# EAGLE schematic RFRemote (EAGLE 6.3)
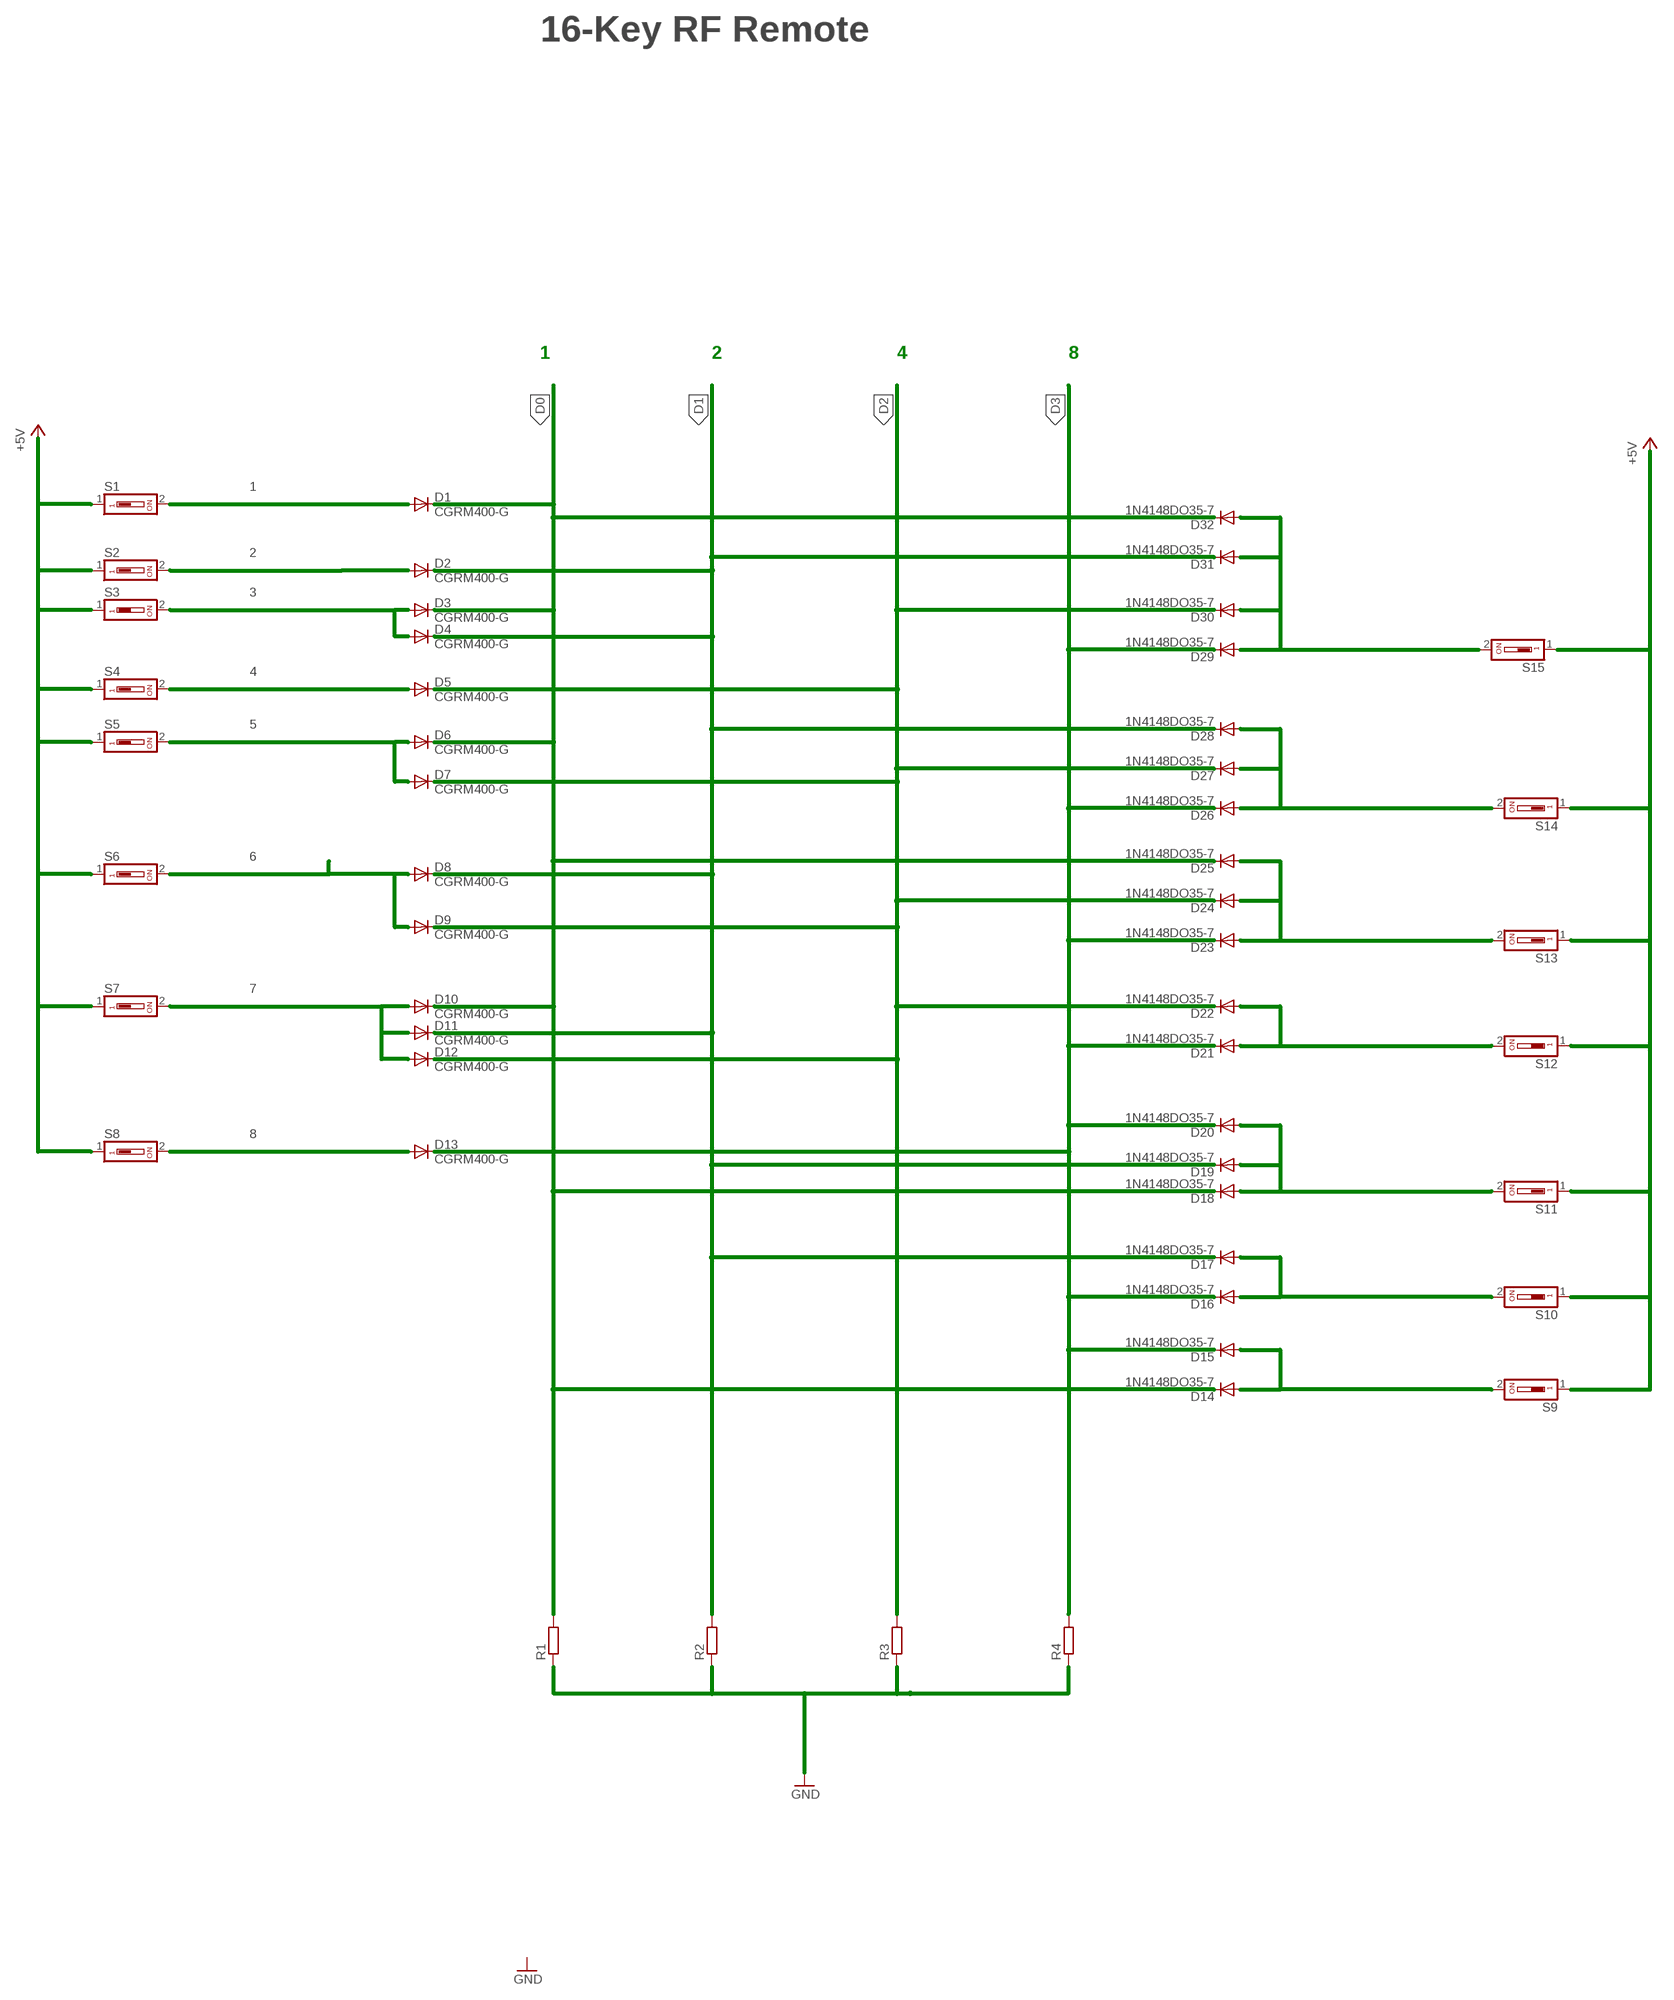
[diagram p0: schematic, sheet 1, part 1 of 2]
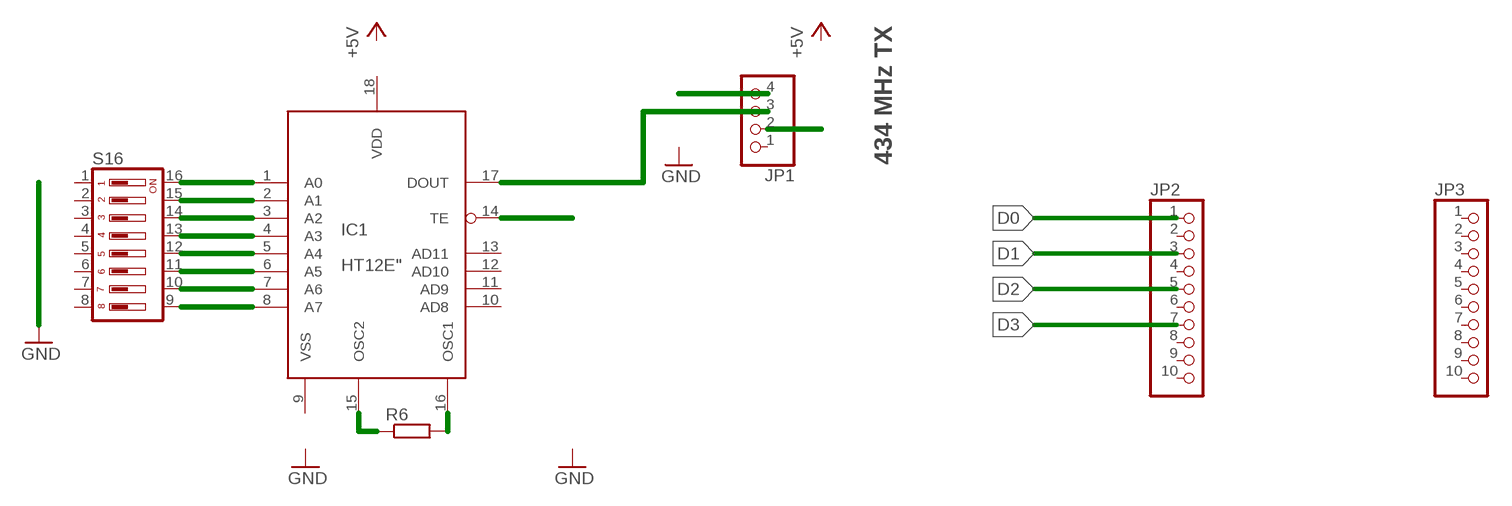
[diagram p1: schematic, sheet 1, part 2 of 2]

## Parts
D1  CGRM400-G  DIODE-3MELF-MLL41  [MELF-MLL41]
D2  CGRM400-G  DIODE-3MELF-MLL41  [MELF-MLL41]
D3  CGRM400-G  DIODE-3MELF-MLL41  [MELF-MLL41]
D4  CGRM400-G  DIODE-3MELF-MLL41  [MELF-MLL41]
D5  CGRM400-G  DIODE-3MELF-MLL41  [MELF-MLL41]
D6  CGRM400-G  DIODE-3MELF-MLL41  [MELF-MLL41]
D7  CGRM400-G  DIODE-3MELF-MLL41  [MELF-MLL41]
D8  CGRM400-G  DIODE-3MELF-MLL41  [MELF-MLL41]
D9  CGRM400-G  DIODE-3MELF-MLL41  [MELF-MLL41]
D10  CGRM400-G  DIODE-3MELF-MLL41  [MELF-MLL41]
D11  CGRM400-G  DIODE-3MELF-MLL41  [MELF-MLL41]
D12  CGRM400-G  DIODE-3MELF-MLL41  [MELF-MLL41]
D13  CGRM400-G  DIODE-3MELF-MLL41  [MELF-MLL41]
D14  1N4148DO35-7  DIODE-MELF-MLL41  [MELF-MLL41]
D15  1N4148DO35-7  DIODE-MELF-MLL41  [MELF-MLL41]
D16  1N4148DO35-7  DIODE-MELF-MLL41  [MELF-MLL41]
D17  1N4148DO35-7  DIODE-MELF-MLL41  [MELF-MLL41]
D18  1N4148DO35-7  DIODE-MELF-MLL41  [MELF-MLL41]
D19  1N4148DO35-7  DIODE-MELF-MLL41  [MELF-MLL41]
D20  1N4148DO35-7  DIODE-MELF-MLL41  [MELF-MLL41]
D21  1N4148DO35-7  DIODE-MELF-MLL41  [MELF-MLL41]
D22  1N4148DO35-7  DIODE-MELF-MLL41  [MELF-MLL41]
D23  1N4148DO35-7  DIODE-MELF-MLL41  [MELF-MLL41]
D24  1N4148DO35-7  DIODE-MELF-MLL41  [MELF-MLL41]
D25  1N4148DO35-7  DIODE-MELF-MLL41  [MELF-MLL41]
D26  1N4148DO35-7  DIODE-MELF-MLL41  [MELF-MLL41]
D27  1N4148DO35-7  DIODE-MELF-MLL41  [MELF-MLL41]
D28  1N4148DO35-7  DIODE-MELF-MLL41  [MELF-MLL41]
D29  1N4148DO35-7  DIODE-MELF-MLL41  [MELF-MLL41]
D30  1N4148DO35-7  DIODE-MELF-MLL41  [MELF-MLL41]
D31  1N4148DO35-7  DIODE-MELF-MLL41  [MELF-MLL41]
D32  1N4148DO35-7  DIODE-MELF-MLL41  [MELF-MLL41]
IC1  HT12E"  [18-DIP-A]
JP1  PINHD-1X4  [1X04]
JP2  PINHD-1X10  [1X10]
JP3  PINHD-1X10  [1X10]
R1  R-EU_R1206  [R1206]
R2  R-EU_R1206  [R1206]
R3  R-EU_R1206  [R1206]
R4  R-EU_R1206  [R1206]
R6  R-EU_0207/10  [0207/10]
S1  SD4-01  [SD4-01]
S2  SD4-01  [SD4-01]
S3  SD4-01  [SD4-01]
S4  SD4-01  [SD4-01]
S5  SD4-01  [SD4-01]
S6  SD4-01  [SD4-01]
S7  SD4-01  [SD4-01]
S8  SD4-01  [SD4-01]
S9  SD4-01  [SD4-01]
S10  SD4-01  [SD4-01]
S11  SD4-01  [SD4-01]
S12  SD4-01  [SD4-01]
S13  SD4-01  [SD4-01]
S14  SD4-01  [SD4-01]
S15  SD4-01  [SD4-01]
S16  DIP08YL  [DIP08YL]

## Nets
1: D1.A S1.2
2: D2.A S2.2
3: D3.A D4.A S3.2
4: D5.A S4.2
5: D6.A D7.A S5.2
6: D8.A D9.A S6.2
7: D10.A D11.A D12.A S7.2
8: D13.A S8.2
+5V: S1.1 S2.1 S3.1 S4.1 S5.1 S6.1 S7.1 S8.1 S9.1 S10.1 S11.1 S12.1 S13.1 S14.1 S15.1
D0: D1.C D3.C D6.C D10.C D14.C D18.C D25.C D32.C JP2.1 R1.2
D1: D2.C D4.C D8.C D11.C D17.C D19.C D28.C D31.C JP2.3 R2.2
D2: D5.C D7.C D9.C D12.C D22.C D24.C D27.C D30.C JP2.5 R3.2
D3: D13.C D15.C D16.C D20.C D21.C D23.C D26.C D29.C JP2.7 R4.2
GND: R1.1 R2.1 R3.1 R4.1
N$1: IC1.17(DOUT) JP1.3
N$2: JP1.4
N$3: JP1.2
N$5: D14.A D15.A S9.2
N$6: D16.A D17.A S10.2
N$15: D18.A D19.A D20.A S11.2
N$16: D21.A D22.A S12.2
N$17: D23.A D24.A D25.A S13.2
N$18: D26.A D27.A D28.A S14.2
N$19: D29.A D30.A D31.A D32.A S15.2
N$20: IC1.16(OSC1) R6.2
N$21: IC1.8(A7) S16.9
N$22: IC1.7(A6) S16.10
N$23: IC1.6(A5) S16.11
N$24: IC1.5(A4) S16.12
N$25: IC1.4(A3) S16.13
N$26: IC1.3(A2) S16.14
N$27: IC1.2(A1) S16.15
N$28: IC1.1(A0) S16.16
N$29: IC1.15(OSC2) R6.1
TE: IC1.14(TE)
Unconnected: IC1.9(VSS) IC1.10(AD8) IC1.11(AD9) IC1.12(AD10) IC1.13(AD11) JP1.1 JP2.2 JP2.4 JP2.6 JP2.8 JP2.9 JP2.10 JP3.1 JP3.2 JP3.3 JP3.4 JP3.5 JP3.6 JP3.7 JP3.8 JP3.9 JP3.10 S16.1 S16.2 S16.3 S16.4 S16.5 S16.6 S16.7 S16.8

## Notes on the sheet
- 16-Key RF Remote
- 1 | 2 | 4 | 8
- 434 MHz TX

## Power pins joined to a net without a drawn wire
VDD: IC1.18(VDD)

## Library data of the parts
D1-D32 = diode:DIODE-: DIODE
IC1 = holtek1:HT12E: transmitter = encoder ic
JP1 = pinhead:PINHD-1X4: PIN HEADER
JP2 JP3 = pinhead:PINHD-1X10: PIN HEADER
R1-R4 R6 = rcl:R-EU_: RESISTOR, European symbol
S1-S15 = switch-dil:SD4-01: DIL/CODE SWITCH; OC_FARNELL: unknown; OC_NEWARK: unknown
S16 = switch-dil:DIP08YL: DIL/CODE SWITCH; OC_FARNELL: unknown; OC_NEWARK: unknown